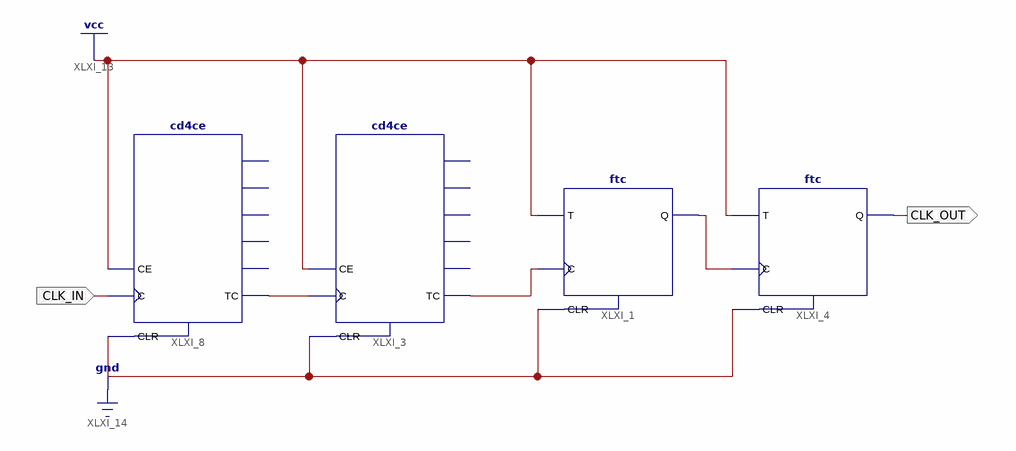
[diagram p0: schematic sheet 1]
// Xilinx ISE schematic DIV_400.sch (spartan6) as structural Verilog: 4 symbols, 2 ports
module DIV_400 (
  input  CLK_IN,
  output CLK_OUT
);

  wire XLXN_1, XLXN_7, XLXN_8;

  ftc XLXI_1 (.C(XLXN_7), .CLR(1'b0), .T(1'b1), .Q(XLXN_1));
  cd4ce XLXI_3 (.C(XLXN_8), .CE(1'b1), .CLR(1'b0), .TC(XLXN_7));  // open: CEO, Q0, Q1, Q2, Q3
  cd4ce XLXI_8 (.C(CLK_IN), .CE(1'b1), .CLR(1'b0), .TC(XLXN_8));  // open: CEO, Q0, Q1, Q2, Q3
  ftc XLXI_4 (.C(XLXN_1), .CLR(1'b0), .T(1'b1), .Q(CLK_OUT));
endmodule
